# Altium schematic sheet Codec.SchDoc
size A3; Author: ALP Electronics; CompanyName: ALP Electronics; DrawnBy: Caner Alp; Engineer: Caner Alp; Organization: ALP Electronics; Address2: Västerås; Address4: Sweden; SheetNumber: 12; SheetTotal: 12
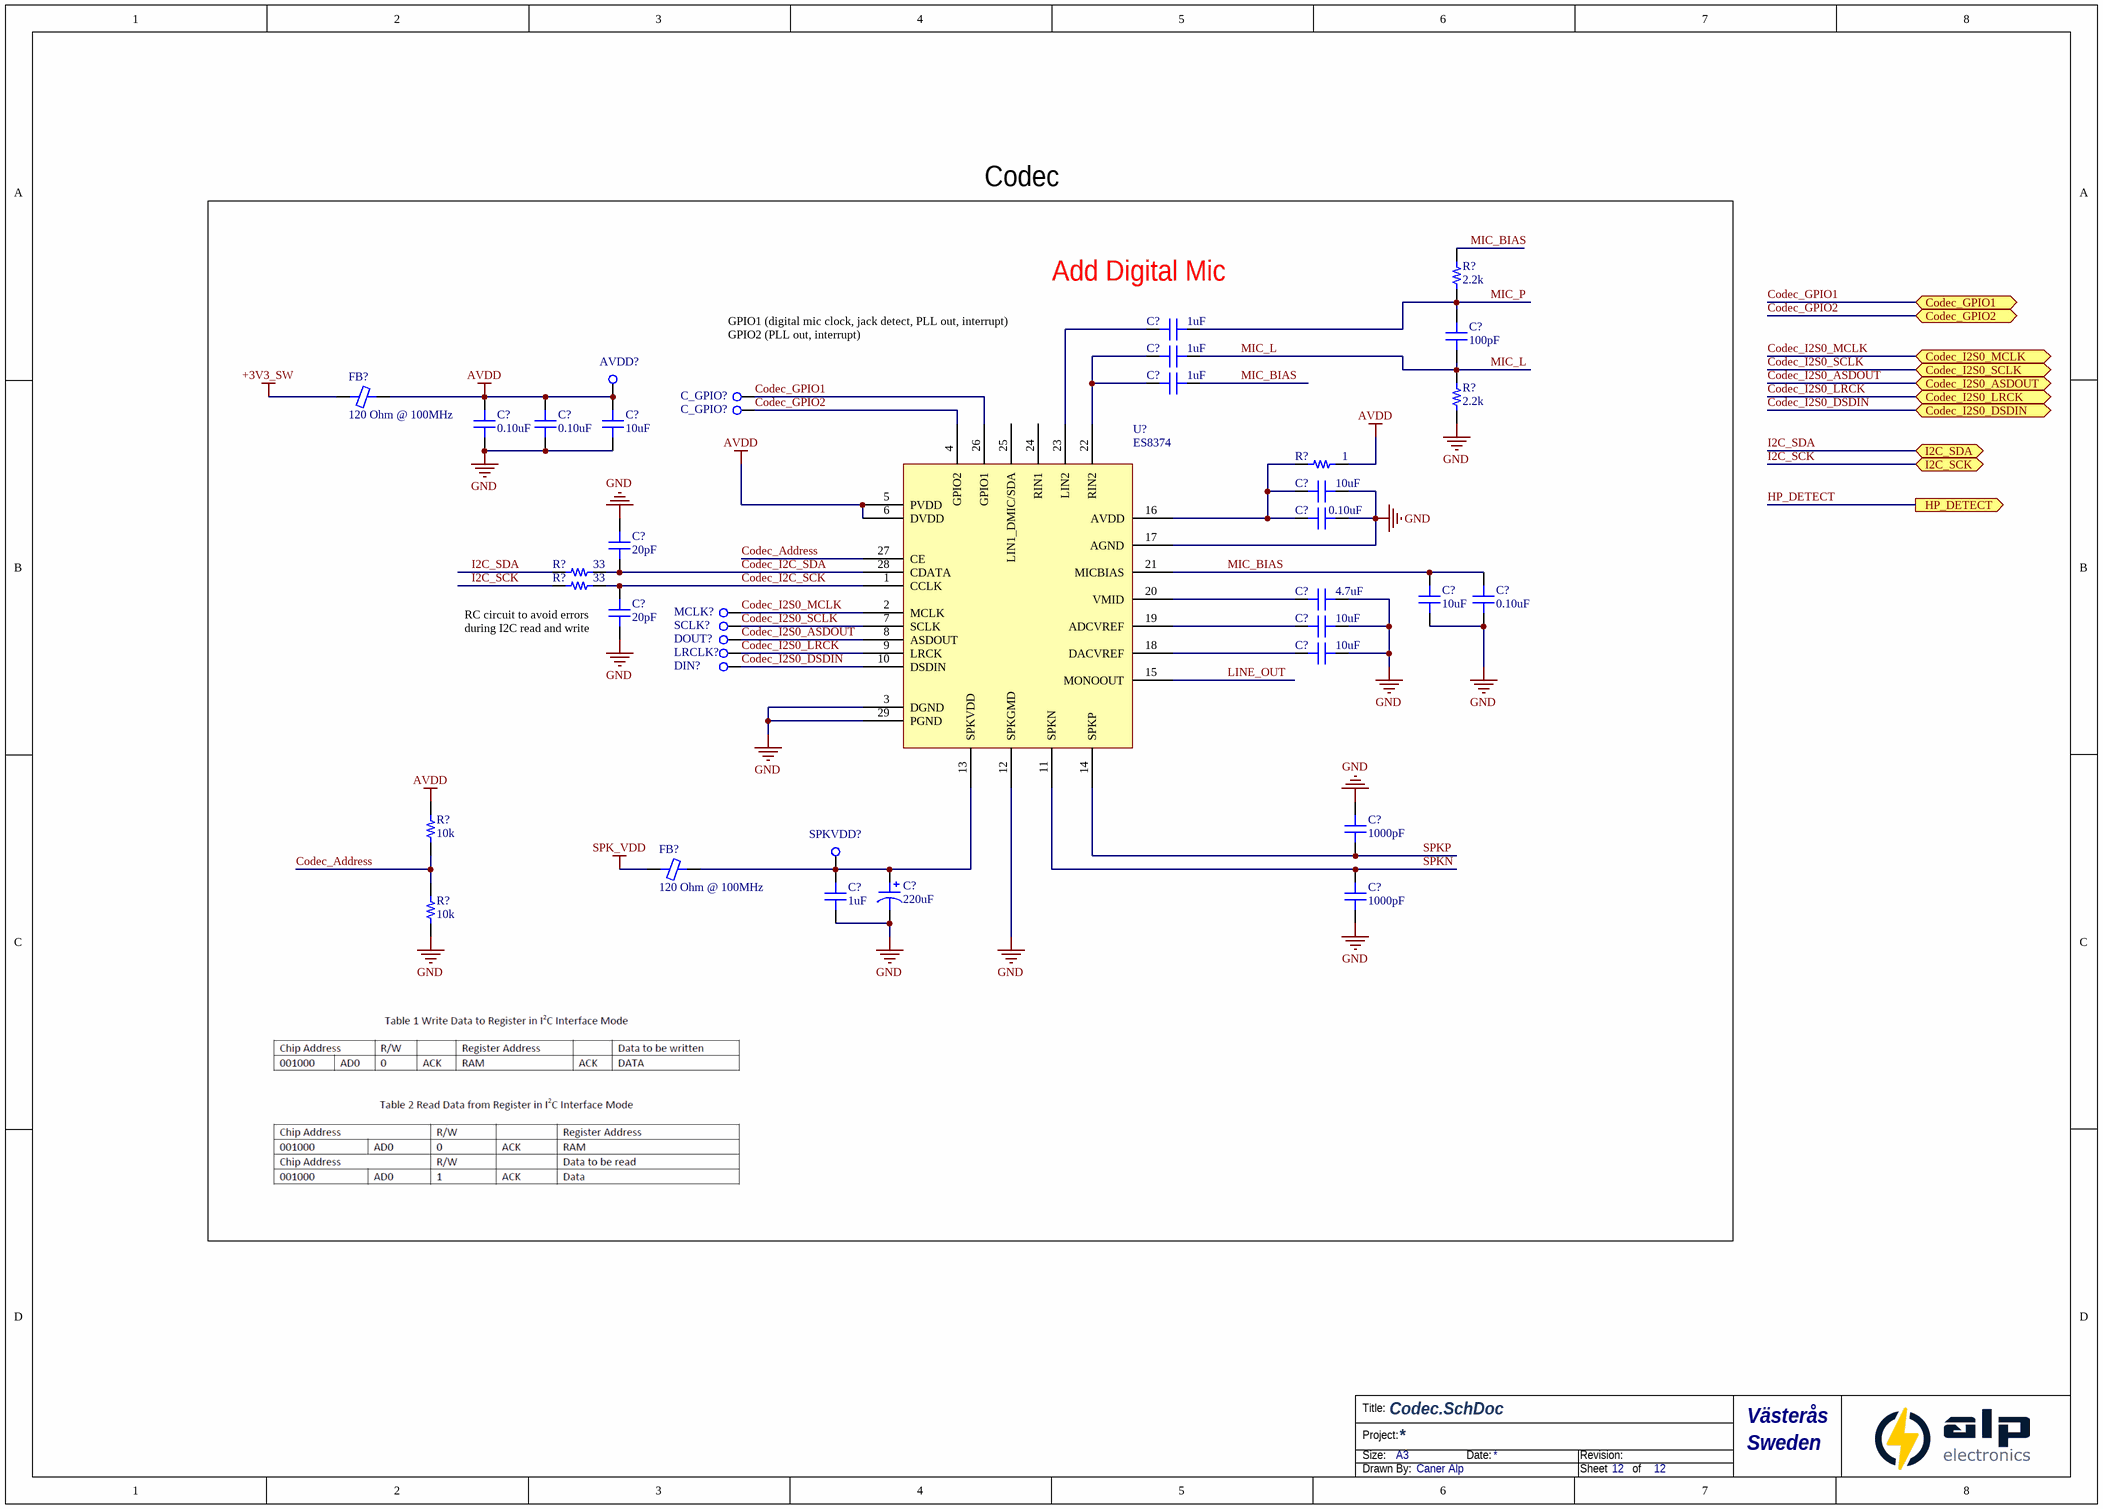
[diagram p0: Codec.SchDoc]

## Parts
(Parts that share a designator on the sheet are numbered #1, #2 ... from top to bottom, then left to right.)
AVDD?  RCT-0C  [0.5mm-TestPad]  (value not drawn)
C?#1  1uF  [CAP 0402/1005]
C?#2  100pF  [CAP 0402/1005]
C?#3  1uF  [CAP 0402/1005]
C?#4  1uF  [CAP 0402/1005]
C?#5  0.10uF  [CAP 0402/1005]
C?#6  0.10uF  [CAP 0402/1005]
C?#7  10uF  [CAP 0402/1005]
C?#8  10uF  [CAP 0402/1005]
C?#9  0.10uF  [CAP 0402/1005]
C?#10  20pF  [CAP 0402/1005]
C?#11  4.7uF  [CAP 0402/1005]
C?#12  10uF  [CAP 0402/1005]
C?#13  0.10uF  [CAP 0402/1005]
C?#14  20pF  [CAP 0402/1005]
C?#15  10uF  [CAP 0402/1005]
C?#16  10uF  [CAP 0402/1005]
C?#17  1000pF  [CAP 0603/1608]
C?#18  1uF  [CAP 0603/1608]
C?#19  220uF  [CAP ALUM 6.6MM]
C?#20  1000pF  [CAP 0603/1608]
C_GPIO?#1  RCT-0C  [0.5mm-TestPad]  (value not drawn)
C_GPIO?#2  RCT-0C  [0.5mm-TestPad]  (value not drawn)
DIN?  RCT-0C  [0.5mm-TestPad]  (value not drawn)
DOUT?  RCT-0C  [0.5mm-TestPad]  (value not drawn)
FB?#1  120 Ohm @ 100MHz  [FER 0402/1005]
FB?#2  120 Ohm @ 100MHz  [FER 0402/1005]
LRCLK?  RCT-0C  [0.5mm-TestPad]  (value not drawn)
MCLK?  RCT-0C  [0.5mm-TestPad]  (value not drawn)
R?#1  2.2k  [RES 0402/1005]
R?#2  2.2k  [RES 0402/1005]
R?#3  1  [RES 0603/1608]
R?#4  33  [RES 0402/1005]
R?#5  33  [RES 0402/1005]
R?#6  10k  [RES 0402/1005]
R?#7  10k  [RES 0402/1005]
SCLK?  RCT-0C  [0.5mm-TestPad]  (value not drawn)
SPKVDD?  RCT-0C  [0.5mm-TestPad]  (value not drawn)
U?  ES8374  [QFN28 4x4mm 0.4mm Pitch]

## Ports
Codec_GPIO1 (bidir), Codec_GPIO2 (bidir), Codec_I2S0_ASDOUT (bidir), Codec_I2S0_DSDIN (bidir), Codec_I2S0_LRCK (bidir), Codec_I2S0_MCLK (bidir), Codec_I2S0_SCLK (bidir), HP_DETECT (out), I2C_SCK (bidir), I2C_SDA (bidir)

## Nets
+3V3_SW: FB?#1.1
AVDD: AVDD?.1(TP) C?#5.1 C?#6.2 C?#7.2 FB?#1.2 R?#3.1 R?#6.2 U?.5(PVDD) U?.6(DVDD)
GND: C?#5.2 C?#6.1 C?#7.1 C?#8.1 C?#9.1 C?#10.2 C?#11.1 C?#12.1 C?#13.1 C?#14.1 C?#15.1 C?#16.1 C?#17.2 C?#18.2 C?#19.2 C?#20.1 R?#2.1 R?#7.1 U?.3(DGND) U?.12(SPKGMD) U?.17(AGND) U?.29(PGND)
SPK_VDD: FB?#2.1
Codec_Address: R?#6.1 R?#7.2 U?.27(CE)
Codec_GPIO1: C_GPIO?#1.1(TP) U?.26(GPIO1) ; port Codec_GPIO1
Codec_GPIO2: C_GPIO?#2.1(TP) U?.4(GPIO2) ; port Codec_GPIO2
Codec_I2C_SCK: C?#14.2 R?#5.2 U?.1(CCLK)
Codec_I2C_SDA: C?#10.1 R?#4.2 U?.28(CDATA)
Codec_I2S0_ASDOUT: DOUT?.1(TP) U?.8(ASDOUT) ; port Codec_I2S0_ASDOUT
Codec_I2S0_DSDIN: DIN?.1(TP) U?.10(DSDIN) ; port Codec_I2S0_DSDIN
Codec_I2S0_LRCK: LRCLK?.1(TP) U?.9(LRCK) ; port Codec_I2S0_LRCK
Codec_I2S0_MCLK: MCLK?.1(TP) U?.2(MCLK) ; port Codec_I2S0_MCLK
Codec_I2S0_SCLK: SCLK?.1(TP) U?.7(SCLK) ; port Codec_I2S0_SCLK
HP_DETECT: port HP_DETECT
I2C_SCK: R?#5.1 ; port I2C_SCK
I2C_SDA: R?#4.1 ; port I2C_SDA
LINE_OUT: U?.15(MONOOUT)
MIC_BIAS: C?#4.1 C?#12.2 C?#13.2 R?#1.2 U?.21(MICBIAS)
MIC_L: C?#2.1 C?#3.1 R?#2.2
MIC_P: C?#1.1 C?#2.2 R?#1.1
SPKN: C?#20.2 U?.11(SPKN)
SPKP: C?#17.1 U?.14(SPKP)
NetC?#1_2: C?#1.2 U?.23(LIN2)
NetC?#3_2: C?#3.2 C?#4.2 U?.22(RIN2)
NetC?#8_2: C?#8.2 C?#9.2 R?#3.2 U?.16(AVDD)
NetC?#11_2: C?#11.2 U?.20(VMID)
NetC?#15_2: C?#15.2 U?.19(ADCVREF)
NetC?#16_2: C?#16.2 U?.18(DACVREF)
NetC?#18_1: C?#18.1 C?#19.1 FB?#2.2 SPKVDD?.1(TP) U?.13(SPKVDD)

Not connected (* = marked no-connect by the designer): U? 24(RIN1) 25(LIN1_DMIC/SDA)

## Notes on the sheet
- Codec
- (near C?#1) Add Digital Mic
- GPIO1 (digital mic clock, jack detect, PLL out, interrupt)
- GPIO2 (PLL out, interrupt)
- RC circuit to avoid errors
  during I2C read and write
- Title:
- Size:
- Project:
- A3
- Date:
- Revision:
- Drawn By:
- Sheet
- of

## Library data of the parts
AVDD? C_GPIO?#1 C_GPIO?#2 DIN? DOUT? LRCLK? MCLK? SCLK? SPKVDD? = RCT-0C: 0805 PROBE PAD; Manufacturer: TE Connectivity AMP Connectors; Part Number: RCT-0C; PartId: 15704; Supplier 1: Digi-Key; Supplier Part Number 1: A106144CT-ND; ComponentLink1Description: Datasheet; ComponentLink1URL: http://www.te.com/commerce/DocumentDelivery/DDEController?Action=srchrtrv&DocNm=1773266&DocType=DS&DocLang=English; ComponentLink2Description: Digi-Key Listing; ComponentLink2URL: http://www.digikey.com/product-detail/en/te-connectivity-amp-connectors/RCT-0C/A106144CT-ND/3477801; Price: 0,14; Type: PC Test Point; Mounting Type: Surface Mount
C?#1 C?#3 C?#4 = GRM155R60J105KE19D: CAP CER 1UF 6.3V X5R 0402; Manufacturer: Murata Electronics North America; TemperatureRange: -55C ~ 85C; Tolerance: 10%; Value: 1uF; Part Number: GRM155R60J105KE19D; PartId: 12330; Supplier 1: Digi-Key; Supplier Part Number 1: 490-1320-2-ND; ComponentLink1Description: Datasheet; ComponentLink1URL: http://www.murata.com/~/media/webrenewal/support/library/catalog/products/capacitor/mlcc/c02e.pdf; ComponentLink2Description: Digi-Key Listing; ComponentLink2URL: https://www.digikey.com/product-detail/en/murata-electronics-north-america/GRM155R60J105KE19D/490-1320-2-ND/587208; TemperatureCoefficient: X5R; Voltage: 6.3V; Price: 0,006; Device Package: 0402 (1005 Metric)
C?#2 = C0402C101J3GACTU: CAP CER 100PF 25V NP0 0402; Manufacturer: Kemet; TemperatureRange: -55C ~ 125C; TemperatureCoefficient: C0G, NP0; Tolerance: 5%; Value: 100pF; Part Number: C0402C101J3GACTU; PartId: 12375; Supplier 1: Digi-Key; Supplier Part Number 1: 399-1022-2-ND; ComponentLink1Description: Datasheet; ComponentLink1URL: http://www.kemet.com/docfinder?Partnumber=C0402C101J3GACTU; ComponentLink2Description: Digi-Key Listing; ComponentLink2URL: https://www.digikey.com/product-detail/en/kemet/C0402C101J3GACTU/399-1022-2-ND/411024; Voltage: 25V; Price: 0,0046; Device Package: 0402 (1005 Metric)
C?#5 C?#6 C?#9 C?#13 = LMK105BJ104KV-F: CAP CER 0.1UF 10V X5R 0402; Manufacturer: Taiyo Yuden; TemperatureRange: -55C ~ 85C; Tolerance: 10%; Value: 0.10uF; Part Number: LMK105BJ104KV-F; PartId: 12322; Supplier 1: Digi-Key; Supplier Part Number 1: 587-1227-2-ND; ComponentLink1Description: Datasheet; ComponentLink1URL: http://ds.yuden.co.jp/TYCOMPAS/ut/detail.do?productNo=LMK105BJ104KV-F&fileName=LMK105BJ104KV-F_SS&mode=specSheetDownload; ComponentLink2Description: Digi-Key Listing; ComponentLink2URL: https://www.digikey.com/product-detail/en/taiyo-yuden/LMK105BJ104KV-F/587-1227-2-ND/930579; TemperatureCoefficient: X5R; Voltage: 10V; Price: 0,0021; Device Package: 0402 (1005 Metric)
C?#7 C?#8 C?#12 C?#15 C?#16 = C1005X5R0J106M050BC: CAP CER 10UF 6.3V X5R 0402; Manufacturer: TDK Corporation; TemperatureRange: -55C ~ 85C; Tolerance: 20%; Value: 10uF; Part Number: C1005X5R0J106M050BC; PartId: 12380; Supplier 1: Digi-Key; Supplier Part Number 1: 445-8920-2-ND; ComponentLink1Description: Datasheet; ComponentLink1URL: https://product.tdk.com/info/en/catalog/datasheets/mlcc_commercial_general_en.pdf; ComponentLink2Description: Digi-Key Listing; ComponentLink2URL: https://www.digikey.com/product-detail/en/tdk-corporation/C1005X5R0J106M050BC/445-8920-2-ND/3507809; TemperatureCoefficient: X5R; Voltage: 6.3V; Price: 0,119; Device Package: 0402 (1005 Metric)
C?#10 C?#14 = GRM1555C1E200JA01D: CAP CER 20PF 25V NP0 0402; Manufacturer: Murata Electronics North America; TemperatureRange: -55C ~ 125C; TemperatureCoefficient: C0G, NP0; Tolerance: 5%; Value: 20pF; Part Number: GRM1555C1E200JA01D; PartId: 5066; Supplier 1: Digi-Key; Supplier Part Number 1: 490-11364-2-ND; ComponentLink1Description: Datasheet; ComponentLink1URL: http://www.murata.com/~/media/webrenewal/support/library/catalog/products/capacitor/mlcc/c02e.ashx; ComponentLink2Description: Digi-Key listing; ComponentLink2URL: http://digikey.com/product-detail/en/GRM1555C1E200JA01D/490-11364-2-ND/3693725; Voltage: 25V; Price: 0,0118; Type: -; Device Package: 0402 (1005 Metric)
C?#11 = C0402C475M9PAC7867: CAP CER 4.7UF 6.3V X5R 0402; Manufacturer: Kemet; TemperatureRange: -55C ~ 85C; Tolerance: 20%; Value: 4.7uF; Part Number: C0402C475M9PAC7867; PartId: 12865; Supplier 1: Digi-Key; Supplier Part Number 1: 399-13068-2-ND; ComponentLink1Description: Datasheet; ComponentLink1URL: http://www.kemet.com/docfinder?Partnumber=C0402C475M9PAC7867; ComponentLink2Description: Digi-Key Listing; ComponentLink2URL: https://www.digikey.com/product-detail/en/kemet/C0402C475M9PAC7867/399-13068-2-ND/5767551; TemperatureCoefficient: X5R; Voltage: 6.3V; Price: 0,063; Device Package: 0402 (1005 Metric)
C?#17 C?#20 = C0603C102K3RACTU: CAP CER 1000PF 25V X7R 0603; Manufacturer: Kemet; TemperatureRange: -55C ~ 125C; Tolerance: 10%; Value: 1000pF; Part Number: C0603C102K3RACTU; PartId: 13145; Supplier 1: Digi-Key; Supplier Part Number 1: 399-7834-2-ND; ComponentLink1Description: Datasheet; ComponentLink1URL: http://www.kemet.com/docfinder?Partnumber=C0603C102K3RACTU; ComponentLink2Description: Digi-Key Listing; ComponentLink2URL: https://www.digikey.com/product-detail/en/kemet/C0603C102K3RACTU/399-7834-2-ND/2199718; TemperatureCoefficient: X7R; Voltage: 25V; Price: 0,0041; Device Package: 0603 (1608 Metric)
C?#18 = CGB3B1X7R1A105K055AC: CAP CER 1UF 10V X7R 0603; Manufacturer: TDK Corporation; TemperatureRange: -55C ~ 125C; Tolerance: 10%; Type: Low Profile; Value: 1uF; Part Number: CGB3B1X7R1A105K055AC; PartId: 4131; Supplier 1: Digi-Key; Supplier Part Number 1: 445-13228-1-ND; ComponentLink1Description: Datasheet; ComponentLink1URL: https://product.tdk.com/info/en/catalog/datasheets/mlcc_commercial_lowprofile_en.pdf; ComponentLink2Description: Digi-Key listing; ComponentLink2URL: http://digikey.com/product-detail/en/CGB3B1X7R1A105K055AC/445-13228-1-ND/3954894; TemperatureCoefficient: X7R; Voltage: 10V; Price: 0,27; Device Package: 0603 (1608 Metric)
C?#19 = EEE-1CA221XP: CAP ALUM 220UF 20% 16V SMD; Manufacturer: Panasonic Electronic Components; TemperatureRange: -40C ~ 85C; Type: Automotive; Ripple Current: 162mA; Lifetime @ Temp: 2000 Hrs @ 85C; Value: 220uF; Part Number: EEE-1CA221XP; PartId: 7248; Supplier 1: Digi-Key; Supplier Part Number 1: PCE3885TR-ND; ComponentLink1Description: Datasheet; ComponentLink1URL: http://media.digikey.com/pdf/Data%20Sheets/Panasonic%20Electronic%20Components/S_Series_Type_V.pdf; ComponentLink2Description: Digi-Key listing; ComponentLink2URL: http://digikey.com/product-detail/en/EEE-1CA221XP/PCE3885TR-ND/766052; Tolerance: 20%; Voltage: 16V; Price: 0,1758; Device Package: Radial, Can - SMD; Impedance: -
FB?#1 FB?#2 = CIM05U121NC: FERRITE CHIP 120 OHM 600MA 0402; Manufacturer: Samsung Electro-Mechanics America, Inc.; Type: Differential Mode - Single; DC Resistance: 250 mOhm Max; Part Number: CIM05U121NC; PartId: 6447; Value: 120 Ohm @ 100MHz; Supplier 1: Digi-Key; Supplier Part Number 1: 1276-6345-2-ND; ComponentLink1Description: Datasheet; ComponentLink1URL: http://www.samsungsem.com/kr/front/downloadcms.do?path=/kr/support/product-search/bead/__icsFiles/afieldfile/2014/11/13&fileName=S_CIM05J102NC.pdf; ComponentLink2Description: Digi-Key listing; ComponentLink2URL: http://digikey.com/product-detail/en/CIM05U121NC/1276-6345-2-ND/3973775; Price: 0,0147; Device Package: 0402 (1005 Metric); Current Rating: 600mA
R?#1 R?#2 = RC0402JR-072K2L: RES SMD 2.2K OHM 5% 1/16W 0402; Manufacturer: Yageo; TemperatureRange: -55C ~ 155C; TemperatureCoefficient: 100ppm/C; PowerRating: 0.063W, 1/16W; Value: 2.2k; Part Number: RC0402JR-072K2L; PartId: 14475; Supplier 1: Digi-Key; Supplier Part Number 1: 311-2.2KJRTR-ND; ComponentLink1Description: Datasheet; ComponentLink1URL: http://www.yageo.com/documents/recent/PYu-RC_Group_51_RoHS_L_04.pdf; ComponentLink2Description: Digi-Key Listing; ComponentLink2URL: https://www.digikey.com/product-detail/en/yageo/RC0402JR-072K2L/311-2.2KJRTR-ND/726436; Tolerance: 5%; Price: 0,0017; Device Package: 0402 (1005 Metric)
R?#3 = ERJ-3GEYJ1R0V: RES SMD 1 OHM 5% 1/10W 0603; Manufacturer: Panasonic Electronic Components; TemperatureRange: -55C ~ 155C; TemperatureCoefficient: -100/ +600ppm/C; PowerRating: 0.1W, 1/10W; Value: 1; Part Number: ERJ-3GEYJ1R0V; PartId: 11204; Supplier 1: Digi-Key; Supplier Part Number 1: P1.0GTR-ND; ComponentLink1Description: Datasheet; ComponentLink1URL: http://industrial.panasonic.com/www-cgi/jvcr13pz.cgi?E+PZ+3+AOA0001+ERJ3GEYJ1R0V+7+WW; ComponentLink2Description: Digi-Key Listing; ComponentLink2URL: https://www.digikey.com/product-detail/en/panasonic-electronic-components/ERJ-3GEYJ1R0V/P1.0GTR-ND/282111; Tolerance: 5%; Price: 0,002; Device Package: 0603 (1608 Metric)
R?#4 R?#5 = ERJ-2GEJ330X: RES SMD 33 OHM 5% 1/10W 0402; Manufacturer: Panasonic Electronic Components; TemperatureRange: -55C ~ 155C; TemperatureCoefficient: 200ppm/C; PowerRating: 0.1W, 1/10W; Value: 33; Part Number: ERJ-2GEJ330X; PartId: 10984; Supplier 1: Digi-Key; Supplier Part Number 1: P33JTR-ND; ComponentLink1Description: Datasheet; ComponentLink1URL: http://industrial.panasonic.com/www-cgi/jvcr13pz.cgi?E+PZ+3+AOA0001+ERJ2GEJ330X+7+WW; ComponentLink2Description: Digi-Key Listing; ComponentLink2URL: https://www.digikey.com/product-detail/en/panasonic-electronic-components/ERJ-2GEJ330X/P33JTR-ND/146980; Tolerance: 5%; Price: 0,0019; Device Package: 0402 (1005 Metric)
R?#6 R?#7 = RC0402JR-0710KL: RES SMD 10K OHM 5% 1/16W 0402; Manufacturer: Yageo; TemperatureRange: -55C ~ 155C; TemperatureCoefficient: 100ppm/C; PowerRating: 0.063W, 1/16W; Value: 10k; Part Number: RC0402JR-0710KL; PartId: 14464; Supplier 1: Digi-Key; Supplier Part Number 1: 311-10KJRTR-ND; ComponentLink1Description: Datasheet; ComponentLink1URL: http://www.yageo.com/documents/recent/PYu-RC_Group_51_RoHS_L_04.pdf; ComponentLink2Description: Digi-Key Listing; ComponentLink2URL: https://www.digikey.com/product-detail/en/yageo/RC0402JR-0710KL/311-10KJRTR-ND/726418; Tolerance: 5%; Price: 0,0017; Device Package: 0402 (1005 Metric)
U? = ES8374: IC AMP AUDIO CODEC  1.8W QFN28; Manufacturer: Evereset Semi; Output Type: 1-Channel (Mono); Max Output Power x Channels @ Load: 1.8W x1 @ 4Ω 4.2V; Voltage Supply: 3.3 V ~ 5 V; Part Number: ES8374; PartId: 9316; Supplier 1: LCSC; Supplier Part Number 1: ES8374; ComponentLink1Description: Datasheet; ComponentLink1URL: https://datasheet.lcsc.com/szlcsc/1912111437_Everest-semi-Everest-Semiconductor-ES8374_C365738.pdf; ComponentLink2Description: LCSC Listing; ComponentLink2URL: https://lcsc.com/product-detail/Codec-ICs_Everest-Semiconductor-ES8374_C365738.html; Type: Class D; Device Package: 28-QFN; Operating Temperature: -40C ~ 85C (TA)